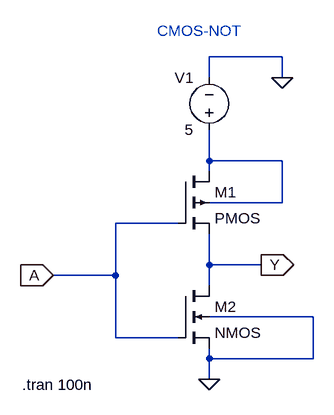
[diagram p0: schematic CMOS_not.asc]
CMOS_not.asc, the LTspice schematic file:
Version 4
SHEET 1 880 680
WIRE 320 16 208 16
WIRE 208 48 208 16
WIRE 320 48 320 16
WIRE 208 176 208 128
WIRE 320 176 208 176
WIRE 208 192 208 176
WIRE 320 240 320 176
WIRE 320 240 208 240
WIRE 160 272 64 272
WIRE 208 336 208 288
WIRE 288 336 208 336
WIRE 64 352 64 272
WIRE 64 352 -32 352
WIRE 208 368 208 336
WIRE 368 416 208 416
WIRE 64 448 64 352
WIRE 160 448 64 448
WIRE 208 480 208 464
WIRE 368 480 368 416
WIRE 368 480 208 480
WIRE 208 512 208 480
FLAG 208 512 0
FLAG 288 336 Y
IOPIN 288 336 Out
FLAG 320 48 0
FLAG -32 352 A
IOPIN -32 352 In
SYMBOL pmos4 160 192 R0
SYMATTR InstName M1
SYMBOL nmos4 160 368 R0
SYMATTR InstName M2
SYMBOL voltage 208 144 R180
WINDOW 0 24 96 Left 2
WINDOW 3 24 16 Left 2
WINDOW 123 0 0 Left 0
WINDOW 39 0 0 Left 0
SYMATTR InstName V1
SYMATTR Value 5
TEXT 128 -24 Left 2 ;CMOS-NOT
TEXT -80 520 Left 2 !.tran 100n

The netlist it stands for:
* CMOS_not.asc
M1 N001 A Y N001 PMOS
M2 Y A 0 0 NMOS
V1 N001 0 5
.model NMOS NMOS
.model PMOS PMOS
.lib standard.mos
* CMOS-NOT
.tran 100n
.backanno
.end